# Altium schematic sheet ConversorRS485.SchDoc
size A4; Engineer: Kayann Soares; SheetNumber: 10; SheetTotal: 11; CompanyInfo1: Universidade Federal do Ceará; CompanyInfo2: Centro de Tecnologia - CT; CompanyInfo3: Dep. de Eng. de Teleinformática
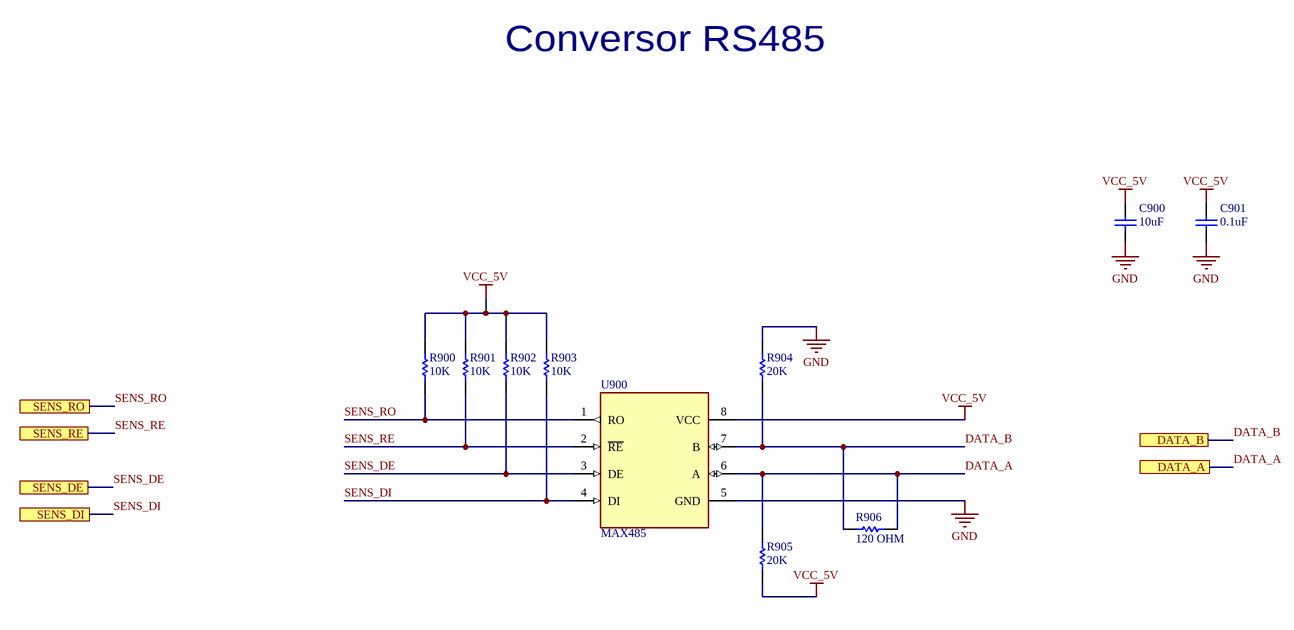
[diagram p0: ConversorRS485.SchDoc]

## Parts
C900  10uF  [CAP_CER_0805]
C901  0.1uF  [CAP_CER_0603]
R900  10K  [RES_0603]
R901  10K  [RES_0603]
R902  10K  [RES_0603]
R903  10K  [RES_0603]
R904  20K  [RES_0603]
R905  20K  [RES_0603]
R906  120 OHM  [RES_0603]
U900  MAX485  [MAX485]

## Ports
DATA_A, DATA_B, SENS_DE, SENS_DI, SENS_RE, SENS_RO

## Nets
GND: C900.2 C901.1 R904.2 U900.5(GND)
VCC_5V: C900.1 C901.2 R900.2 R901.2 R902.2 R903.2 R905.1 U900.8(VCC)
DATA_A: R905.2 R906.2 U900.6(A) ; port DATA_A
DATA_B: R904.1 R906.1 U900.7(B) ; port DATA_B
SENS_DE: R902.1 U900.3(DE) ; port SENS_DE
SENS_DI: R903.1 U900.4(DI) ; port SENS_DI
SENS_RE: R901.1 U900.2(~{RE}) ; port SENS_RE
SENS_RO: R900.1 U900.1(RO) ; port SENS_RO

## Notes on the sheet
- Conversor RS485
- Título:
- Padrão:
- Projeto:
- Eng. Responsável:
- A4
- Data:
- Versão:
- Folha:
- V1
- de
- Arquivo:

## Library data of the parts
C900 = CAP_CER_10uF_0805: Supplier 1: Arrow Electronics; Supplier Part Number 1: CL21A106KOQNNNE
C901 = CAP_CER_0.1uF_0603: Supplier 1: Digi-Key Marketplace; Supplier Part Number 1: 2571-GMC10X7R104J25NTTR-ND
R900-R903 = RES_10K_0603: Supplier 1: Digi-Key Marketplace; Supplier Part Number 1: 2571-RM06J103CTTR-ND
R904 R905 = RES_20K_0603: Supplier 1: Future Electronics; Supplier Part Number 1: 7472848
R906 = RES_120OHM_0603: Supplier 1: Future Electronics; Supplier Part Number 1: 7110726
U900 = MAX485: Supplier 1: Arrow Electronics; Supplier Part Number 1: MAX485ESA+T